# Altium project MagControl.PrjPCB (part 1 of 2)
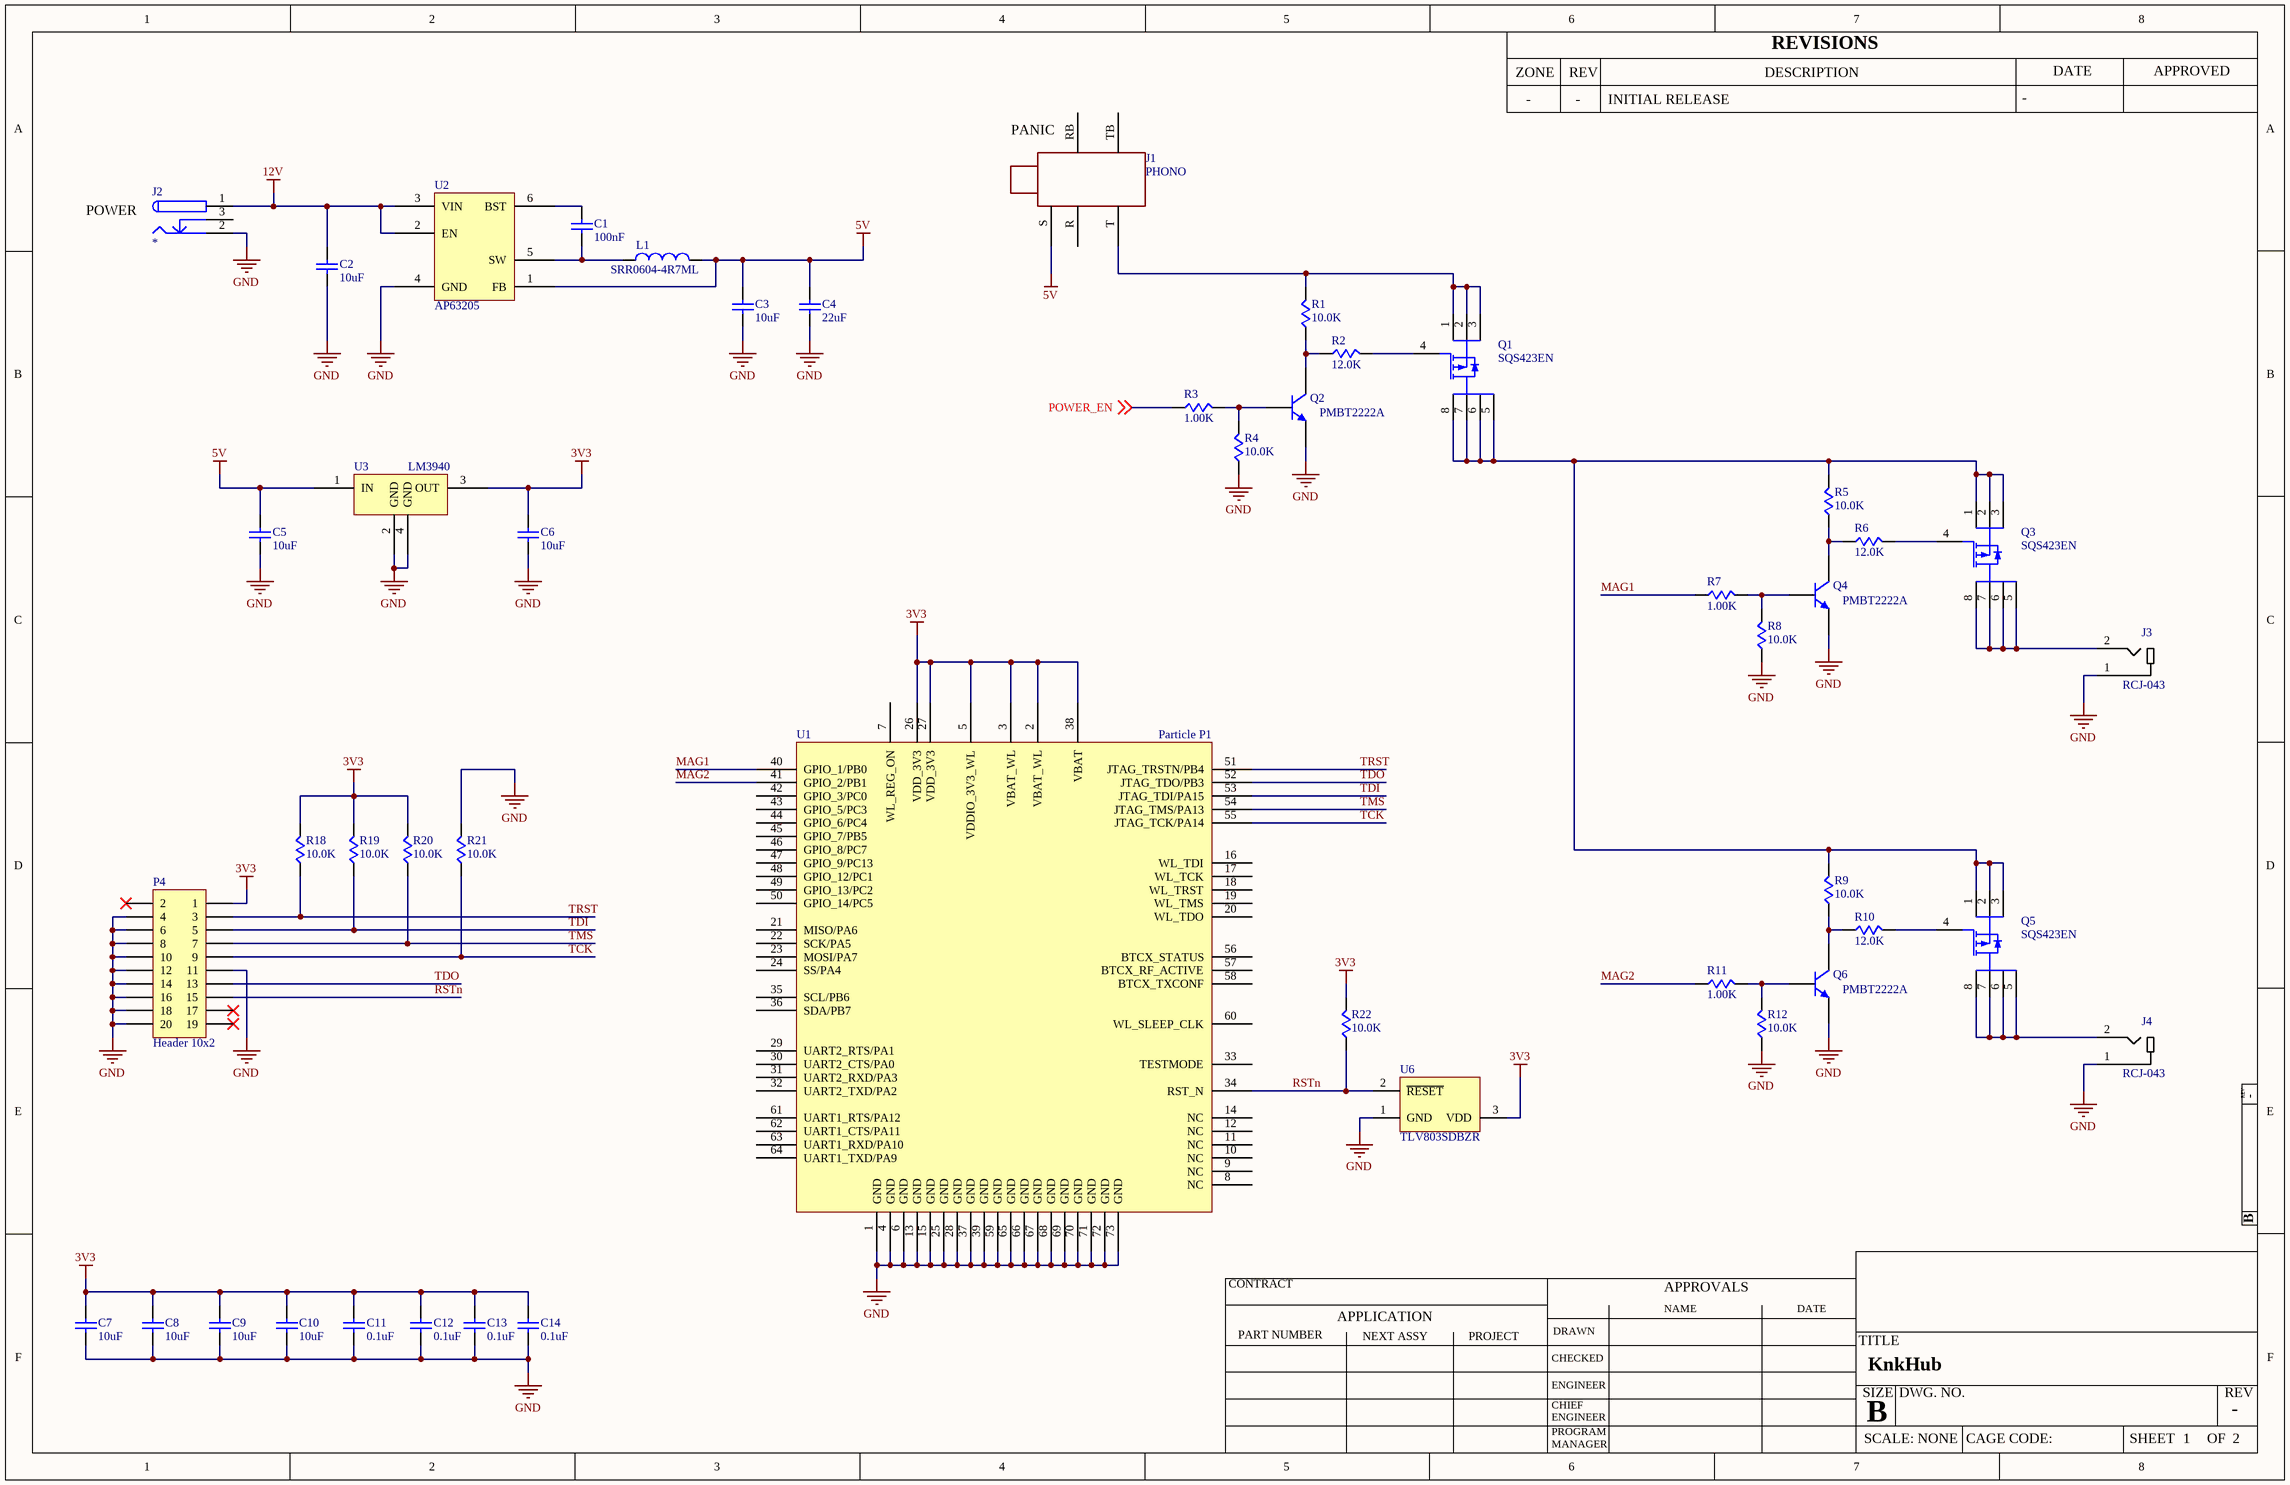
[diagram p0: SCH_MagControl_Sheet1.SchDoc]
2 sheets, 68 parts. Net scope: global (net labels, ports and power ports of the same name join across sheets).
Board file: MagControl.PcbDoc
Sheets:
  SCH_MagControl_Sheet1.SchDoc
  SCH_MagControl_Sheet2.SchDoc

## Sheet SCH_MagControl_Sheet1.SchDoc: KnkHub
size 431 x 279 mm; Revision: -; SheetNumber: 1; SheetTotal: 2; PageSetup: Record=PageOptions|CenterHorizontal=True|CenterVertical=True|PrintScale=0.98|XCorrection=1.00|YCorrection=1.00|PrintKind=1|BorderSize=5000000|LeftOffset=0|BottomOffset=0|Orientation=2|PaperLength=1000|PaperWidth=1000|Scale=100|PaperSource=15|PrintQuality=600|MediaType=1|DitherType=10|PaperKind=11 x 17|PrintScaleMode=1

### Parts
C1  value 100nF  [CAPC1608L]
C2  value 10uF  [CAPC2012L]
C3  value 10uF  [CAPC2012L]
C4  value 22uF  [CAPC2012L]
C5  value 10uF  [CAPC1608L]
C6  value 10uF  [CAPC1608L]
C7  value 10uF  [CAPC1608L]
C8  value 10uF  [CAPC1608L]
C9  value 10uF  [CAPC1608L]
C10  value 10uF  [CAPC1608L]
C11  value 0.1uF  [CAPC2012L]
C12  value 0.1uF  [CAPC2012L]
C13  value 0.1uF  [CAPC2012L]
C14  value 0.1uF  [CAPC2012L]
J1  value PHONO  [SN37A12]
J2  (no value)  [PJ-002B-SMT]
J3  value RCJ-043  [CUI_RCJ-043]
J4  value RCJ-043  [CUI_RCJ-043]
L1  value SRR0604-4R7ML  [IND_BOURNS_SRR06]
P4  value Header 10x2  [C-5103308-5]
Q1  value SQS423EN  [POWER-PAK 1212-8]
Q2  value PMBT2222A  [SOT23_N]
Q3  value SQS423EN  [POWER-PAK 1212-8]
Q4  value PMBT2222A  [SOT23_N]
Q5  value SQS423EN  [POWER-PAK 1212-8]
Q6  value PMBT2222A  [SOT23_N]
R1  value 10.0K  [RESC1005N]
R2  value 12.0K  [RESC1005N]
R3  value 1.00K  [RESC1005N]
R4  value 10.0K  [RESC1005N]
R5  value 10.0K  [RESC1005N]
R6  value 12.0K  [RESC1005N]
R7  value 1.00K  [RESC1005N]
R8  value 10.0K  [RESC1005N]
R9  value 10.0K  [RESC1005N]
R10  value 12.0K  [RESC1005N]
R11  value 1.00K  [RESC1005N]
R12  value 10.0K  [RESC1005N]
R18  value 10.0K  [RESC1005N]
R19  value 10.0K  [RESC1005N]
R20  value 10.0K  [RESC1005N]
R21  value 10.0K  [RESC1005N]
R22  value 10.0K  [RESC1005N]
U1  value Particle P1  [PARTICLE_P1]
U2  value AP63205  [TSOT26-6N]
U3  value LM3940  [SOT223-4N]
U6  value TLV803SDBZR  [DBZ0003A_L]

### Nets
3V3: C6.2 C7.2 C8.2 C9.2 C10.2 C11.2 C12.2 C13.2 C14.2 P4.1 R18.2 R19.2 R20.2 R22.2 U1.2(VBAT_WL) U1.3(VBAT_WL) U1.5(VDDIO_3V3_WL) U1.26(VDD_3V3) U1.27(VDD_3V3) U1.38(VBAT) U3.3(OUT) U6.3(VDD)
5V: C3.2 C4.2 C5.2 J1.S L1.2 U2.1(FB) U3.1(IN)
12V: C2.2 J2.1 U2.2(EN) U2.3(VIN)
GND: C2.1 C3.1 C4.1 C5.1 C6.1 C7.1 C8.1 C9.1 C10.1 C11.1 C12.1 C13.1 C14.1 J2.2 J3.1 J4.1 P4.4 P4.6 P4.8 P4.10 P4.11 P4.12 P4.14 P4.16 P4.18 P4.20 Q2.2(E) Q4.2(E) Q6.2(E) R4.1 R8.1 R12.1 R21.2 U1.1(GND) U1.4(GND) U1.6(GND) U1.13(GND) U1.15(GND) U1.25(GND) U1.28(GND) U1.37(GND) U1.39(GND) U1.59(GND) U1.65(GND) U1.66(GND) U1.67(GND) U1.68(GND) U1.69(GND) U1.70(GND) U1.71(GND) U1.72(GND) U1.73(GND) U2.4(GND) U3.2(GND) U3.4(GND) U6.1(GND)
MAG1: R7.1 U1.40(GPIO_1/PB0)
MAG2: R11.1 U1.41(GPIO_2/PB1)
POWER_EN: R3.1 ; off-sheet POWER_EN
RSTn: P4.15 R22.1 U1.34(RST_N) U6.2(~{RESET})
TCK: P4.9 R21.1 U1.55(JTAG_TCK/PA14)
TDI: P4.5 R19.1 U1.53(JTAG_TDI/PA15)
TDO: P4.13 U1.52(JTAG_TDO/PB3)
TMS: P4.7 R20.1 U1.54(JTAG_TMS/PA13)
TRST: P4.3 R18.1 U1.51(JTAG_TRSTN/PB4)
NetC1_1: C1.1 L1.1 U2.5(SW)
NetC1_2: C1.2 U2.6(BST)
NetJ1_T: J1.T Q1.1(S) Q1.2(S) Q1.3(S) R1.2
NetJ3_2: J3.2 Q3.5(D) Q3.6(D) Q3.7(D) Q3.8(D)
NetJ4_2: J4.2 Q5.5(D) Q5.6(D) Q5.7(D) Q5.8(D)
NetQ1_4: Q1.4(G) R2.2
NetQ1_5: Q1.5(D) Q1.6(D) Q1.7(D) Q1.8(D) Q3.1(S) Q3.2(S) Q3.3(S) Q5.1(S) Q5.2(S) Q5.3(S) R5.2 R9.2
NetQ2_1: Q2.1(B) R3.2 R4.2
NetQ2_3: Q2.3(C) R1.1 R2.1
NetQ3_4: Q3.4(G) R6.2
NetQ4_1: Q4.1(B) R7.2 R8.2
NetQ4_3: Q4.3(C) R5.1 R6.1
NetQ5_4: Q5.4(G) R10.2
NetQ6_1: Q6.1(B) R11.2 R12.2
NetQ6_3: Q6.3(C) R9.1 R10.1

Not connected (* = marked no-connect by the designer): J1 R RB TB; J2 3; P4 2* 17* 19*; U1 7(WL_REG_ON) 8(NC) 9(NC) 10(NC) 11(NC) 12(NC) 14(NC) 16(WL_TDI) 17(WL_TCK) 18(WL_TRST) 19(WL_TMS) 20(WL_TDO) 21(MISO/PA6) 22(SCK/PA5) 23(MOSI/PA7) 24(SS/PA4) 29(UART2_RTS/PA1) 30(UART2_CTS/PA0) 31(UART2_RXD/PA3) 32(UART2_TXD/PA2) 33(TESTMODE) 35(SCL/PB6) 36(SDA/PB7) 42(GPIO_3/PC0) 43(GPIO_5/PC3) 44(GPIO_6/PC4) 45(GPIO_7/PB5) 46(GPIO_8/PC7) 47(GPIO_9/PC13) 48(GPIO_12/PC1) 49(GPIO_13/PC2) 50(GPIO_14/PC5) 56(BTCX_STATUS) 57(BTCX_RF_ACTIVE) 58(BTCX_TXCONF) 60(WL_SLEEP_CLK) 61(UART1_RTS/PA12) 62(UART1_CTS/PA11) 63(UART1_RXD/PA10) 64(UART1_TXD/PA9)

### Notes on the sheet
- (near J1) PANIC
- POWER
- ZONE
- REV
- DESCRIPTION
- REVISIONS
- DATE
- APPROVED
- -
- INITIAL RELEASE
- B
- CONTRACT
- APPROVALS
- PART NUMBER
- APPLICATION
- NEXT ASSY
- PROJECT
- CHECKED
- DRAWN
- NAME
- TITLE
- ENGINEER
- CHIEF
- PROGRAM
- SIZE
- DWG. NO.
- MANAGER
- SCALE: NONE
- CAGE CODE:
- SHEET
- OF

### Library data of the parts
C1 = Cap Semi: Capacitor (SMD); Manufacturer 1: Samsung; Manufacturer Part Number 1: CL10B104KO8NNNC; Material: Ceramic; Dielectric: X7R; Tolerance: 10%; Voltage Rating (DC): 16V; ComponentLink1URL: https://datasheet.ciiva.com/26838/getdatasheetpartid-357417-26838418.pdf?src-supplier=Verical; ComponentLink1Description: https://datasheet.ciiva.com/26838/getdatasheetpartid-357417-26838418.pdf?src-supplier=Verical; ComponentLink2URL: https://datasheet.ciiva.com/25805/cl10b104ko8nnnc-25805483.pdf?src-supplier=Digi-Key; ComponentLink2Description: https://datasheet.ciiva.com/25805/cl10b104ko8nnnc-25805483.pdf?src-supplier=Digi-Key; ComponentLink3URL: https://datasheet.ciiva.com/29198/456679-da-01-en-vs-kondensator-0603-29198846.pdf?src-supplier=Conrad; ComponentLink3Description: https://datasheet.ciiva.com/29198/456679-da-01-en-vs-kondensator-0603-29198846.pdf?src-supplier=Conrad; Supplier 1: Digi-Key; Supplier Part Number 1: 1276-1005-1-ND; Mount: Surface Mount; Case/Package: 0603; Case Code (Metric): 1608; Case Code (Imperial): 0603; Contact Plating: Tin; Min Operating Temperature: -55°C; Max Operating Temperature: 125°C; Capacitance: 100nF; Packaging: Tape and Reel; Package Quantity: 1; Voltage Rating: 16V; Voltage: 16V; Length: 1.6mm; Height: 0.8mm; Depth: 0.8mm; Width: 0.031inch; Thickness: 0.035inch; Radiation Hardening: No; Lead Free: Lead Free
C2 C3 = Cap Semi: Capacitor (SMD); Manufacturer 1: Samsung; Manufacturer Part Number 1: CL21A106KOQNNNG; Material: Ceramic; Tolerance: 10%; Dielectric: X5R; Voltage: 16V; ComponentLink1URL: https://datasheet.ciiva.com/16428/cl21a106kpfnnng-16428896.pdf?src-supplier=Future+Electronics; ComponentLink1Description: https://datasheet.ciiva.com/16428/cl21a106kpfnnng-16428896.pdf?src-supplier=Future+Electronics; ComponentLink2URL: https://datasheet.ciiva.com/26936/getdatasheetpartid-640497-26936900.pdf?src-supplier=Verical; ComponentLink2Description: https://datasheet.ciiva.com/26936/getdatasheetpartid-640497-26936900.pdf?src-supplier=Verical; ComponentLink3URL: https://datasheet.ciiva.com/25730/cl21a106koqnnng-25730226.pdf?src-supplier=Digi-Key; ComponentLink3Description: https://datasheet.ciiva.com/25730/cl21a106koqnnng-25730226.pdf?src-supplier=Digi-Key; ComponentLink4URL: https://datasheet.ciiva.com/29199/454932-da-01-en-vs-kondensator-0805-29199423.pdf?src-supplier=Conrad; ComponentLink4Description: https://datasheet.ciiva.com/29199/454932-da-01-en-vs-kondensator-0805-29199423.pdf?src-supplier=Conrad; Supplier 1: Digi-Key; Supplier Part Number 1: 1276-6455-6-ND; Mount: Surface Mount; Case/Package: 0805; Case Code (Metric): 2012; Case Code (Imperial): 0805; Min Operating Temperature: -55°C; Max Operating Temperature: 85°C; Capacitance: 10uF; Packaging: Tape and Reel; Package Quantity: 3000; Voltage Rating: 16V; Length: 2mm; Height: 1.25mm; Depth: 1.25mm; Width: 0.049inch; Thickness: 0.053inch
C4 = Cap Semi: Capacitor (SMD); Manufacturer 1: Samsung; Manufacturer Part Number 1: CL21A226KQCLRNC; Voltage Rating: 6.3V; Tolerance: 10%; Supplier 1: Digi-Key; Supplier Part Number 1: 1276-6687-1-ND; Mount: Surface Mount; Case/Package: 0805; Case Code (Metric): 2012; Case Code (Imperial): 0805; Min Operating Temperature: -55°C; Max Operating Temperature: 85°C; Packaging: Tape and Reel; Capacitance: 22uF; Length: 0.079inch; Width: 0.049inch; Thickness: 0.037inch; ComponentLink1URL: http://www.samsungsem.com/kr/support/product-search/mlcc/CL21A226KQCLRNC.jsp?src-supplier=Digi-Key; ComponentLink1Description: http://www.samsungsem.com/kr/support/product-search/mlcc/CL21A226KQCLRNC.jsp?src-supplier=Digi-Key
C5-C10 = Cap Semi: Capacitor (SMD); Manufacturer 1: Samsung; Manufacturer Part Number 1: CL10A106MQ8NNNC; Tolerance: 20%; Voltage Rating: 6.3V; Dielectric: X5R; Supplier 1: Digi-Key; Supplier Part Number 1: 1276-1119-1-ND; Mount: Surface Mount; Case/Package: 0603; Case Code (Metric): 1608; Case Code (Imperial): 0603; Contact Plating: Tin; Min Operating Temperature: -55°C; Max Operating Temperature: 85°C; Capacitance: 10uF; Package Quantity: 1; Packaging: Tape and Reel; Voltage: 6.3V; Length: 1.6mm; Height: 0.8mm; Width: 0.031inch; Thickness: 0.035inch; Depth: 0.8mm; Radiation Hardening: No; ComponentLink1URL: https://datasheet.ciiva.com/25798/cl10a106mq8nnnc-25798320.pdf?src-supplier=Digi-Key; ComponentLink1Description: https://datasheet.ciiva.com/25798/cl10a106mq8nnnc-25798320.pdf?src-supplier=Digi-Key; ComponentLink2URL: https://datasheet.ciiva.com/26838/getdatasheetpartid-357557-26838347.pdf?src-supplier=Verical; ComponentLink2Description: https://datasheet.ciiva.com/26838/getdatasheetpartid-357557-26838347.pdf?src-supplier=Verical; ComponentLink3URL: https://datasheet.ciiva.com/16437/cl05b104kq5nnnc-16437327.pdf?src-supplier=Future+Electronics; ComponentLink3Description: https://datasheet.ciiva.com/16437/cl05b104kq5nnnc-16437327.pdf?src-supplier=Future+Electronics; ComponentLink4URL: http://www.samsungsem.com/kr/support/product-search/mlcc/CL10X106MO8NRNC.jsp?src-supplier=Digi-Key; ComponentLink4Description: http://www.samsungsem.com/kr/support/product-search/mlcc/CL10X106MO8NRNC.jsp?src-supplier=Digi-Key
C11-C14 = Cap Semi: Capacitor (SMD); Manufacturer 1: Samsung; Manufacturer Part Number 1: CL05A104MP5NNNC; Capacitance: 100nF; Tolerance: 20%; Voltage Rating: 10V; Dielectric: X5R; Supplier 1: Digi-Key; Supplier Part Number 1: 1276-1443-1-ND; Mount: Surface Mount; Case/Package: 0402; Case Code (Metric): 1005; Case Code (Imperial): 0402; Min Operating Temperature: -55°C; Max Operating Temperature: 85°C; Packaging: Tape and Reel; Voltage Rating (DC): 10V; Length: 1mm; Height: 0.5mm; Width: 0.02inch; Thickness: 0.022inch; Depth: 0.5mm; Radiation Hardening: No; Lead Free: Lead Free; ComponentLink1URL: https://datasheet.ciiva.com/25709/cl05a104mp5nnnc-25709105.pdf?src-supplier=Digi-Key; ComponentLink1Description: https://datasheet.ciiva.com/25709/cl05a104mp5nnnc-25709105.pdf?src-supplier=Digi-Key
J1 = PHONO_250: Manufacturer 1: Switchcraft; Manufacturer Part Number 1: SN37A12A; Gender: Female; Shielding: Unshielded; Voltage Rating: 500V; Number of Ports: 1; Number of Contacts: 2; Pitch: 7.62mm; Supplier 1: Digi-Key; Supplier Part Number 1: SC2014-ND; Mount: Through Hole; Contact Material: Brass; Color: Black; Contact Plating: Nickel; Number of Terminals: 4; Housing Color: Black; Housing Material: Thermoplastic; Package Quantity: 1; Termination: Solder; Orientation: Right Angle; Number of Positions: 2; Length: 15.87mm; Lead Free: Lead Free; ComponentLink1URL: https://datasheet.ciiva.com/390/sn37a1-cd-390736.pdf?src-supplier=Digi-Key; ComponentLink1Description: https://datasheet.ciiva.com/390/sn37a1-cd-390736.pdf?src-supplier=Digi-Key; ComponentLink2URL: https://datasheet.ciiva.com/16148/jack-95-16148456.pdf?src-supplier=Onlinecomponents.com; ComponentLink2Description: https://datasheet.ciiva.com/16148/jack-95-16148456.pdf?src-supplier=Onlinecomponents.com
J2 = PWR2.5: Low Voltage Power Supply Connector; Manufacturer 1: CUI; Manufacturer Part Number 1: PJ-002BH; Gender: Male; Shielding: Unshielded; Current Rating: 5A; Connector Type: Jack; Voltage Rating: 24V; Insulation Resistance: 100MR; Number of Conductors: 2; Value: *; Supplier 1: Digi-Key; Supplier Part Number 1: CP-002BH-ND; Mount: Through Hole; Color: Black; Contact Material: Copper; Contact Plating: Nickel; Housing Color: Black; Housing Material: Thermoplastic; Min Operating Temperature: -25°C; Max Operating Temperature: 85°C; Termination: Through Hole; Package Quantity: 500; Packaging: Bulk; Contact Gender: Male; Orientation: Horizontal; Diameter: 2.5mm; Lead Free: Lead Free; Flammability Rating: UL94 V-0; ComponentLink1URL: http://www.mouser.com/ds/2/670/pj-002bh-528069.pdf?src-supplier=Mouser; ComponentLink1Description: http://www.mouser.com/ds/2/670/pj-002bh-528069.pdf?src-supplier=Mouser; ComponentLink2URL: http://www.cui.com/Product/Resource/FuturePDF/PJ-002BH.pdf?src-supplier=Future+Electronics; ComponentLink2Description: http://www.cui.com/Product/Resource/FuturePDF/PJ-002BH.pdf?src-supplier=Future+Electronics; ComponentLink3URL: https://www.cui.com/product/resource/digikeypdf/pj-002bh.pdf?src-supplier=Digi-Key; ComponentLink3Description: https://www.cui.com/product/resource/digikeypdf/pj-002bh.pdf?src-supplier=Digi-Key
J3 J4 = RCJ-043: CONN RCA JACK MONO 3.2MM R/A; Manufacturer 1: CUI; Body Material: Brass; Gender: Female; Shielding: Unshielded; Number of Ports: 1; Supplier 1: Digi-Key; Supplier Part Number 1: CP-1420-ND; Manufacturer Part Number 1: RCJ-043; Mount: Through Hole; Contact Plating: Nickel; Color: White; Insulation Color: White; Packaging: Bulk; Termination: Solder; Orientation: Horizontal; Connector Type: Jack; Lead Free: Lead Free; ComponentLink1URL: https://www.cui.com/product/resource/digikeypdf/rcj-04x.pdf?src-supplier=Digi-Key; ComponentLink1Description: https://www.cui.com/product/resource/digikeypdf/rcj-04x.pdf?src-supplier=Digi-Key
L1 = Inductor: Manufacturer 1: Bourns; Core Material: Ferrite; Material: Steel; Tolerance: 20%; Inductance: 4.7uH; DC Resistance (DCR): 60mR; Max DC Current: 2A; Saturation Current: 2.55A; Shielding: Shielded; Self Resonant Frequency: 50MHz; Q Factor: 10; Test Frequency: 1kHz; Manufacturer Part Number 1: SRR0604-4R7ML; Supplier 1: Digi-Key; Supplier Part Number 1: SRR0604-4R7MLCT-ND; Mount: Surface Mount; Case/Package: Nonstandard; Number of Pins: 2; Min Operating Temperature: -40°C; Max Operating Temperature: 125°C; Package Quantity: 1; Current Rating: 2A; Packaging: Tape and Reel; Inductance Tolerance: 20%; Frequency: 50MHz; Resistance: 60MR; Composition: Wirewound; Termination: SMD/SMT; DC Current: 2A; Military Standard: Not; RMS Current (Irms): 2A; Length: 6.5mm; Height: 4.8mm; Width: 6.5mm; Height - Seated (Max): 0.189inch; Depth: 6.7mm; REACH SVHC: No SVHC; ComponentLink1URL: https://datasheet.ciiva.com/7849/1723201-7849753.pdf?src-supplier=Element14; ComponentLink1Description: https://datasheet.ciiva.com/7849/1723201-7849753.pdf?src-supplier=Element14; ComponentLink2URL: https://datasheet.ciiva.com/30139/srr0604-30139818.pdf?src-supplier=Onlinecomponents.com; ComponentLink2Description: https://datasheet.ciiva.com/30139/srr0604-30139818.pdf?src-supplier=Onlinecomponents.com; ComponentLink3URL: https://datasheet.ciiva.com/1062/srr0604-1062306.pdf?src-supplier=Digi-Key; ComponentLink3Description: https://datasheet.ciiva.com/1062/srr0604-1062306.pdf?src-supplier=Digi-Key; ComponentLink4URL: https://datasheet.ciiva.com/8517/srr0604-8517206.pdf?src-supplier=Avnet; ComponentLink4Description: https://datasheet.ciiva.com/8517/srr0604-8517206.pdf?src-supplier=Avnet; ComponentLink5URL: https://datasheet.ciiva.com/7849/1483755-7849754.pdf?src-supplier=Element14; ComponentLink5Description: https://datasheet.ciiva.com/7849/1483755-7849754.pdf?src-supplier=Element14; ComponentLink6URL: https://datasheet.ciiva.com/17247/srr0604-17247630.pdf?src-supplier=Avnet+Europe; ComponentLink6Description: https://datasheet.ciiva.com/17247/srr0604-17247630.pdf?src-supplier=Avnet+Europe
P4 = HEADER10X2: Manufacturer Part Number 1: 51033085; Manufacturer 1: TE Connectivity; Number of Contacts: 20; Connector Type: Plug; Mating Alignment: Yes (With); PCB Mount Retention: Without; PCB Mounting Orientation: Vertical; Current Rating: 1A; Insulation Resistance: 5GR; Max Voltage Rating (AC): 250V; Board Standoff: No (Without); Connector System: Wire-to-Board; Pitch: 2.54mm; Contact Post Length: 0.12inch; Supplier 1: Digi-Key; Supplier Part Number 1: A33165-ND; Mount: Through Hole; Contact Plating: Gold; Contact Material: Copper Alloy; Color: Black; Housing Color: Black; Housing Material: PBT; Contact Shape: Square; Min Operating Temperature: -65°C; Max Operating Temperature: 105°C; Number of Rows: 2; Termination: Through Hole; Packaging: Rail/Tube; Package Quantity: 35; Number of Positions: 20; Orientation: Straight; Contact Current Rating: 1A; Contact Gender: Male; PCB Mount Alignment: No (Without); Shrouded: Yes (With); Mating Connector Lock: No (Without); Mating Retention: No (Without); Voltage Rating: 250V; Length: 33.02mm; Height: 8.813mm; Row Spacing: 2.54mm; Depth: 9.14mm; Contact Mating Length: 0.24inch; Shrouded End Dimension: 3.81mm; Flammability Rating: UL94 V-0; REACH SVHC: No SVHC; ComponentLink1URL: https://datasheet.ciiva.com/11750/0900766b804f3401-11750371.pdf?src-supplier=RSComponents; ComponentLink1Description: https://datasheet.ciiva.com/11750/0900766b804f3401-11750371.pdf?src-supplier=RSComponents; ComponentLink2URL: https://datasheet.ciiva.com/19463/753539-19463412.pdf?src-supplier=Jameco; ComponentLink2Description: https://datasheet.ciiva.com/19463/753539-19463412.pdf?src-supplier=Jameco; ComponentLink3URL: https://datasheet.ciiva.com/30233/eng-ds-1307819-ampmodu-0811-30233221.pdf?src-supplier=Onlinecomponents.com; ComponentLink3Description: https://datasheet.ciiva.com/30233/eng-ds-1307819-ampmodu-0811-30233221.pdf?src-supplier=Onlinecomponents.com; ComponentLink4URL: https://datasheet.ciiva.com/14638/70042631-14638263.pdf?src-supplier=Allied+Electronics; ComponentLink4Description: https://datasheet.ciiva.com/14638/70042631-14638263.pdf?src-supplier=Allied+Electronics; ComponentLink5URL: https://datasheet.ciiva.com/710/eng-cd-5103308-e-710220.pdf?src-supplier=Digi-Key; ComponentLink5Description: https://datasheet.ciiva.com/710/eng-cd-5103308-e-710220.pdf?src-supplier=Digi-Key
Q1 Q3 Q5 = MOSFET-P_PPAK: MOSFET P-CH PPAK-8; Manufacturer 1: Vishay Semiconductors; Manufacturer Part Number 1: SQS423EN-T1_GE3; Rise Time: 43ns; Continuous Drain Current (ID): 16A; Turn-On Delay Time: 65ns; Turn-Off Delay Time: 23ns; Fall Time: 15ns; Gate to Source Voltage (Vgs): 20V; Number of Elements: 1; Power Dissipation: 62.5W; Supplier 1: Digi-Key; Supplier Part Number 1: SQS423EN-T1_GE3CT-ND; Mount: Surface Mount; Number of Pins: 8; Min Operating Temperature: -55°C; Max Operating Temperature: 175°C; Packaging: Tape and Reel; Radiation Hardening: No; ComponentLink1URL: https://datasheet.ciiva.com/26133/sqs423en-26133606.pdf?src-supplier=Avnet+Europe; ComponentLink1Description: https://datasheet.ciiva.com/26133/sqs423en-26133606.pdf?src-supplier=Avnet+Europe; ComponentLink2URL: https://datasheet.ciiva.com/11160/sqs423en-11160394.pdf?src-supplier=Avnet; ComponentLink2Description: https://datasheet.ciiva.com/11160/sqs423en-11160394.pdf?src-supplier=Avnet
Q2 Q4 Q6 = PMBT2222: TRANS NPN SW 600MA 40V SOT23; Manufacturer Part Number 1: PMBT2222A,215; Manufacturer 1: Nexperia; Supplier 1: Digi-Key; Supplier Part Number 1: 1727-2956-1-ND; ComponentLink1URL: http://www.farnell.com/datasheets/1274664.pdf?src-supplier=Farnell; ComponentLink1Description: http://www.farnell.com/datasheets/1274664.pdf?src-supplier=Farnell
R1 R4 R5 R8 R9 R12 = R: RES 10.0K OHM 1/10W 1% 0402 SMD; Manufacturer 1: Panasonic; Manufacturer Part Number 1: ERJ-2RKF1002X; Resistance: 10kR; Temperature Coefficient: 100ppm/°C; Power Rating: 100mW; Voltage Rating: 50V; Supplier 1: Digi-Key; Supplier Part Number 1: P10.0KLCT-ND; Mount: Surface Mount; Case/Package: 0402; Number of Pins: 2; Contact Plating: Tin; Case Code (Metric): 1005; Case Code (Imperial): 0402; Min Operating Temperature: -55°C; Max Operating Temperature: 155°C; Tolerance: 1%; Composition: Thick Film; Packaging: Tape and Reel; Package Quantity: 1; Number of Terminations: 2; Termination: SMD/SMT; Military Standard: Not; Max Power Dissipation: 100mW; Voltage Rating (DC): 50V; Features: Automotive AEC-Q200; Length: 1mm; Height: 0.35mm; Width: 0.02inch; Depth: 0.5mm; Radiation Hardening: No; REACH SVHC: No SVHC; Lead Free: Lead Free; ComponentLink1URL: https://datasheet.ciiva.com/11821/0900766b80f80784-11821171.pdf?src-supplier=RSComponents; ComponentLink1Description: https://datasheet.ciiva.com/11821/0900766b80f80784-11821171.pdf?src-supplier=RSComponents; ComponentLink2URL: https://datasheet.ciiva.com/17212/aoa0000ce2-17212102.pdf?src-supplier=Avnet+Europe; ComponentLink2Description: https://datasheet.ciiva.com/17212/aoa0000ce2-17212102.pdf?src-supplier=Avnet+Europe; ComponentLink3URL: https://datasheet.ciiva.com/28514/1678782-28514185.pdf?src-supplier=Element14; ComponentLink3Description: https://datasheet.ciiva.com/28514/1678782-28514185.pdf?src-supplier=Element14; ComponentLink4URL: https://datasheet.ciiva.com/43467/1678782-43467402.pdf?src-supplier=Farnell; ComponentLink4Description: https://datasheet.ciiva.com/43467/1678782-43467402.pdf?src-supplier=Farnell; ComponentLink5URL: https://datasheet.ciiva.com/27055/1987020-27055643.pdf?src-supplier=Jameco; ComponentLink5Description: https://datasheet.ciiva.com/27055/1987020-27055643.pdf?src-supplier=Jameco; ComponentLink6URL: https://datasheet.ciiva.com/48531/aoa0000ce2-48531069.pdf?src-supplier=Avnet; ComponentLink6Description: https://datasheet.ciiva.com/48531/aoa0000ce2-48531069.pdf?src-supplier=Avnet; ComponentLink7URL: https://datasheet.ciiva.com/30201/aoa0000ce2-30201022.pdf?src-supplier=Onlinecomponents.com; ComponentLink7Description: https://datasheet.ciiva.com/30201/aoa0000ce2-30201022.pdf?src-supplier=Onlinecomponents.com; ComponentLink8URL: https://datasheet.ciiva.com/16199/aoa0000ce2-16199478.pdf?src-supplier=Future+Electronics; ComponentLink8Description: https://datasheet.ciiva.com/16199/aoa0000ce2-16199478.pdf?src-supplier=Future+Electronics; ComponentLink9URL: https://datasheet.ciiva.com/24023/aoa0000ce2-24023017.pdf?src-supplier=Mouser; ComponentLink9Description: https://datasheet.ciiva.com/24023/aoa0000ce2-24023017.pdf?src-supplier=Mouser; ComponentLink10URL: https://datasheet.ciiva.com/9194/aoa0000ce2-9194142.pdf?src-supplier=Avnet; ComponentLink10Description: https://datasheet.ciiva.com/9194/aoa0000ce2-9194142.pdf?src-supplier=Avnet; ComponentLink11URL: https://datasheet.ciiva.com/16782/70260748-16782590.pdf?src-supplier=Allied+Electronics; ComponentLink11Description: https://datasheet.ciiva.com/16782/70260748-16782590.pdf?src-supplier=Allied+Electronics; ComponentLink12URL: https://datasheet.ciiva.com/16786/70260748-16786734.pdf?src-supplier=Allied+Electronics; ComponentLink12Description: https://datasheet.ciiva.com/16786/70260748-16786734.pdf?src-supplier=Allied+Electronics
R2 R6 R10 = R: RES 12.0K OHM 1/10W 1% 0402 SMD; Manufacturer 1: Panasonic; Manufacturer Part Number 1: ERJ-2RKF1202X; Resistance: 12kR; Power Rating: 100mW; Voltage Rating: 50V; Temperature Coefficient: 100ppm/°C; Supplier 1: Digi-Key; Supplier Part Number 1: P12.0KLCT-ND; Mount: Surface Mount; Case/Package: 0402; Number of Pins: 2; Case Code (Metric): 1005; Case Code (Imperial): 0402; Contact Plating: Tin; Min Operating Temperature: -55°C; Max Operating Temperature: 155°C; Tolerance: 1%; Packaging: Tape and Reel; Package Quantity: 1; Composition: Thick Film; Number of Terminations: 2; Termination: SMD/SMT; Military Standard: Not; Max Power Dissipation: 100mW; Voltage Rating (DC): 50V; Features: Automotive AEC-Q200; Length: 1mm; Height: 0.35mm; Width: 0.02inch; Depth: 0.5mm; REACH SVHC: No SVHC; Lead Free: Lead Free; ComponentLink1URL: https://datasheet.ciiva.com/7944/426256-7944939.pdf?src-supplier=Element14; ComponentLink1Description: https://datasheet.ciiva.com/7944/426256-7944939.pdf?src-supplier=Element14; ComponentLink2URL: https://datasheet.ciiva.com/7944/aoa0000ce2-7944604.pdf?src-supplier=Element14; ComponentLink2Description: https://datasheet.ciiva.com/7944/aoa0000ce2-7944604.pdf?src-supplier=Element14; ComponentLink3URL: https://datasheet.ciiva.com/22673/1678782-22673676.pdf?src-supplier=Element14; ComponentLink3Description: https://datasheet.ciiva.com/22673/1678782-22673676.pdf?src-supplier=Element14; ComponentLink4URL: https://datasheet.ciiva.com/46373/1678782-46373164.pdf?src-supplier=Element14; ComponentLink4Description: https://datasheet.ciiva.com/46373/1678782-46373164.pdf?src-supplier=Element14; ComponentLink5URL: https://datasheet.ciiva.com/22687/1678782-22687405.pdf?src-supplier=Element14; ComponentLink5Description: https://datasheet.ciiva.com/22687/1678782-22687405.pdf?src-supplier=Element14; ComponentLink6URL: https://datasheet.ciiva.com/46373/1678782-46373165.pdf?src-supplier=Element14; ComponentLink6Description: https://datasheet.ciiva.com/46373/1678782-46373165.pdf?src-supplier=Element14
R3 = R: RES 1.00K OHM 1/10W 1% 0402 SMD; Manufacturer 1: Panasonic; Manufacturer Part Number 1: ERJ-2RKF1001X; Resistance: 10kR; Temperature Coefficient: 100ppm/°C; Power Rating: 100mW; Voltage Rating: 50V; Supplier 1: Digi-Key; Supplier Part Number 1: P1.00KLCT-ND; Mount: Surface Mount; Case/Package: 0402; Number of Pins: 2; Contact Plating: Tin; Case Code (Metric): 1005; Case Code (Imperial): 0402; Min Operating Temperature: -55°C; Max Operating Temperature: 155°C; Tolerance: 1%; Composition: Thick Film; Packaging: Tape and Reel; Package Quantity: 1; Number of Terminations: 2; Termination: SMD/SMT; Military Standard: Not; Max Power Dissipation: 100mW; Voltage Rating (DC): 50V; Features: Automotive AEC-Q200; Length: 1mm; Height: 0.35mm; Width: 0.02inch; Depth: 0.5mm; Radiation Hardening: No; REACH SVHC: No SVHC; Lead Free: Lead Free; ComponentLink1URL: https://datasheet.ciiva.com/11821/0900766b80f80784-11821171.pdf?src-supplier=RSComponents; ComponentLink1Description: https://datasheet.ciiva.com/11821/0900766b80f80784-11821171.pdf?src-supplier=RSComponents; ComponentLink2URL: https://datasheet.ciiva.com/17212/aoa0000ce2-17212102.pdf?src-supplier=Avnet+Europe; ComponentLink2Description: https://datasheet.ciiva.com/17212/aoa0000ce2-17212102.pdf?src-supplier=Avnet+Europe; ComponentLink3URL: https://datasheet.ciiva.com/28514/1678782-28514185.pdf?src-supplier=Element14; ComponentLink3Description: https://datasheet.ciiva.com/28514/1678782-28514185.pdf?src-supplier=Element14; ComponentLink4URL: https://datasheet.ciiva.com/43467/1678782-43467402.pdf?src-supplier=Farnell; ComponentLink4Description: https://datasheet.ciiva.com/43467/1678782-43467402.pdf?src-supplier=Farnell; ComponentLink5URL: https://datasheet.ciiva.com/27055/1987020-27055643.pdf?src-supplier=Jameco; ComponentLink5Description: https://datasheet.ciiva.com/27055/1987020-27055643.pdf?src-supplier=Jameco; ComponentLink6URL: https://datasheet.ciiva.com/48531/aoa0000ce2-48531069.pdf?src-supplier=Avnet; ComponentLink6Description: https://datasheet.ciiva.com/48531/aoa0000ce2-48531069.pdf?src-supplier=Avnet; ComponentLink7URL: https://datasheet.ciiva.com/30201/aoa0000ce2-30201022.pdf?src-supplier=Onlinecomponents.com; ComponentLink7Description: https://datasheet.ciiva.com/30201/aoa0000ce2-30201022.pdf?src-supplier=Onlinecomponents.com; ComponentLink8URL: https://datasheet.ciiva.com/16199/aoa0000ce2-16199478.pdf?src-supplier=Future+Electronics; ComponentLink8Description: https://datasheet.ciiva.com/16199/aoa0000ce2-16199478.pdf?src-supplier=Future+Electronics; ComponentLink9URL: https://datasheet.ciiva.com/24023/aoa0000ce2-24023017.pdf?src-supplier=Mouser; ComponentLink9Description: https://datasheet.ciiva.com/24023/aoa0000ce2-24023017.pdf?src-supplier=Mouser; ComponentLink10URL: https://datasheet.ciiva.com/9194/aoa0000ce2-9194142.pdf?src-supplier=Avnet; ComponentLink10Description: https://datasheet.ciiva.com/9194/aoa0000ce2-9194142.pdf?src-supplier=Avnet; ComponentLink11URL: https://datasheet.ciiva.com/16782/70260748-16782590.pdf?src-supplier=Allied+Electronics; ComponentLink11Description: https://datasheet.ciiva.com/16782/70260748-16782590.pdf?src-supplier=Allied+Electronics; ComponentLink12URL: https://datasheet.ciiva.com/16786/70260748-16786734.pdf?src-supplier=Allied+Electronics; ComponentLink12Description: https://datasheet.ciiva.com/16786/70260748-16786734.pdf?src-supplier=Allied+Electronics; Working Voltage: 50V; ComponentLink13URL: https://datasheet.ciiva.com/11821/0900766b80f80784-11821203.pdf?src-supplier=RSComponents; ComponentLink13Description: https://datasheet.ciiva.com/11821/0900766b80f80784-11821203.pdf?src-supplier=RSComponents; ComponentLink14URL: https://datasheet.ciiva.com/16767/70260748-16767559.pdf?src-supplier=Allied+Electronics; ComponentLink14Description: https://datasheet.ciiva.com/16767/70260748-16767559.pdf?src-supplier=Allied+Electronics; ComponentLink15URL: https://datasheet.ciiva.com/9198/aoa0000ce2-9198920.pdf?src-supplier=Avnet; ComponentLink15Description: https://datasheet.ciiva.com/9198/aoa0000ce2-9198920.pdf?src-supplier=Avnet; ComponentLink16URL: https://datasheet.ciiva.com/7942/aoa0000ce2-7942426.pdf?src-supplier=Element14; ComponentLink16Description: https://datasheet.ciiva.com/7942/aoa0000ce2-7942426.pdf?src-supplier=Element14; ComponentLink17URL: https://datasheet.ciiva.com/16523/aoa0000ce2-16523834.pdf?src-supplier=Avnet+Asia; ComponentLink17Description: https://datasheet.ciiva.com/16523/aoa0000ce2-16523834.pdf?src-supplier=Avnet+Asia; ComponentLink18URL: https://datasheet.ciiva.com/16771/70260748-16771979.pdf?src-supplier=Allied+Electronics; ComponentLink18Description: https://datasheet.ciiva.com/16771/70260748-16771979.pdf?src-supplier=Allied+Electronics; ComponentLink19URL: https://datasheet.ciiva.com/17215/aoa0000ce2-17215308.pdf?src-supplier=Avnet+Europe; ComponentLink19Description: https://datasheet.ciiva.com/17215/aoa0000ce2-17215308.pdf?src-supplier=Avnet+Europe; ComponentLink20URL: https://datasheet.ciiva.com/22673/1678782-22673916.pdf?src-supplier=Element14; ComponentLink20Description: https://datasheet.ciiva.com/22673/1678782-22673916.pdf?src-supplier=Element14; ComponentLink21URL: https://datasheet.ciiva.com/28532/1678782-28532109.pdf?src-supplier=Element14; ComponentLink21Description: https://datasheet.ciiva.com/28532/1678782-28532109.pdf?src-supplier=Element14
R7 R11 = R: RES 1.00K OHM 1/10W 1% 0402 SMD; Manufacturer 1: Panasonic; Manufacturer Part Number 1: ERJ-2RKF1001X; Resistance: 1kR; Temperature Coefficient: 100ppm/°C; Voltage Rating: 50V; Power Rating: 100mW; Supplier 1: Digi-Key; Supplier Part Number 1: P1.00KLCT-ND; Mount: Surface Mount; Case/Package: 0402; Number of Pins: 2; Contact Plating: Tin; Case Code (Imperial): 0402; Case Code (Metric): 1005; Min Operating Temperature: -55°C; Max Operating Temperature: 155°C; Tolerance: 1%; Composition: Thick Film; Packaging: Tape and Reel; Package Quantity: 1; Termination: SMD/SMT; Number of Terminations: 2; Military Standard: Not; Max Power Dissipation: 100mW; Voltage Rating (DC): 50V; Features: Automotive AEC-Q200; Working Voltage: 50V; Length: 1mm; Height: 0.35mm; Width: 0.5mm; Depth: 0.5mm; Radiation Hardening: No; REACH SVHC: No SVHC; Lead Free: Lead Free; ComponentLink1URL: https://datasheet.ciiva.com/11821/0900766b80f80784-11821203.pdf?src-supplier=RSComponents; ComponentLink1Description: https://datasheet.ciiva.com/11821/0900766b80f80784-11821203.pdf?src-supplier=RSComponents; ComponentLink2URL: https://datasheet.ciiva.com/16767/70260748-16767559.pdf?src-supplier=Allied+Electronics; ComponentLink2Description: https://datasheet.ciiva.com/16767/70260748-16767559.pdf?src-supplier=Allied+Electronics; ComponentLink3URL: https://datasheet.ciiva.com/9198/aoa0000ce2-9198920.pdf?src-supplier=Avnet; ComponentLink3Description: https://datasheet.ciiva.com/9198/aoa0000ce2-9198920.pdf?src-supplier=Avnet; ComponentLink4URL: https://datasheet.ciiva.com/7942/aoa0000ce2-7942426.pdf?src-supplier=Element14; ComponentLink4Description: https://datasheet.ciiva.com/7942/aoa0000ce2-7942426.pdf?src-supplier=Element14; ComponentLink5URL: https://datasheet.ciiva.com/16523/aoa0000ce2-16523834.pdf?src-supplier=Avnet+Asia; ComponentLink5Description: https://datasheet.ciiva.com/16523/aoa0000ce2-16523834.pdf?src-supplier=Avnet+Asia; ComponentLink6URL: https://datasheet.ciiva.com/16771/70260748-16771979.pdf?src-supplier=Allied+Electronics; ComponentLink6Description: https://datasheet.ciiva.com/16771/70260748-16771979.pdf?src-supplier=Allied+Electronics; ComponentLink7URL: https://datasheet.ciiva.com/17215/aoa0000ce2-17215308.pdf?src-supplier=Avnet+Europe; ComponentLink7Description: https://datasheet.ciiva.com/17215/aoa0000ce2-17215308.pdf?src-supplier=Avnet+Europe; ComponentLink8URL: https://datasheet.ciiva.com/22673/1678782-22673916.pdf?src-supplier=Element14; ComponentLink8Description: https://datasheet.ciiva.com/22673/1678782-22673916.pdf?src-supplier=Element14; ComponentLink9URL: https://datasheet.ciiva.com/28532/1678782-28532109.pdf?src-supplier=Element14; ComponentLink9Description: https://datasheet.ciiva.com/28532/1678782-28532109.pdf?src-supplier=Element14
R18-R22 = R: RES 1.00K OHM 1/10W 1% 0402 SMD; Manufacturer 1: Panasonic; Manufacturer Part Number 1: ERJ-2RKF1002X; Resistance: 10kR; Temperature Coefficient: 100ppm/°C; Power Rating: 100mW; Voltage Rating: 50V; Supplier 1: Digi-Key; Supplier Part Number 1: P10.0KLCT-ND; Mount: Surface Mount; Case/Package: 0402; Number of Pins: 2; Contact Plating: Tin; Case Code (Metric): 1005; Case Code (Imperial): 0402; Min Operating Temperature: -55°C; Max Operating Temperature: 155°C; Tolerance: 1%; Composition: Thick Film; Packaging: Tape and Reel; Package Quantity: 1; Number of Terminations: 2; Termination: SMD/SMT; Military Standard: Not; Max Power Dissipation: 100mW; Voltage Rating (DC): 50V; Features: Automotive AEC-Q200; Length: 1mm; Height: 0.35mm; Width: 0.02inch; Depth: 0.5mm; Radiation Hardening: No; REACH SVHC: No SVHC; Lead Free: Lead Free; ComponentLink1URL: https://datasheet.ciiva.com/11821/0900766b80f80784-11821171.pdf?src-supplier=RSComponents; ComponentLink1Description: https://datasheet.ciiva.com/11821/0900766b80f80784-11821171.pdf?src-supplier=RSComponents; ComponentLink2URL: https://datasheet.ciiva.com/17212/aoa0000ce2-17212102.pdf?src-supplier=Avnet+Europe; ComponentLink2Description: https://datasheet.ciiva.com/17212/aoa0000ce2-17212102.pdf?src-supplier=Avnet+Europe; ComponentLink3URL: https://datasheet.ciiva.com/28514/1678782-28514185.pdf?src-supplier=Element14; ComponentLink3Description: https://datasheet.ciiva.com/28514/1678782-28514185.pdf?src-supplier=Element14; ComponentLink4URL: https://datasheet.ciiva.com/43467/1678782-43467402.pdf?src-supplier=Farnell; ComponentLink4Description: https://datasheet.ciiva.com/43467/1678782-43467402.pdf?src-supplier=Farnell; ComponentLink5URL: https://datasheet.ciiva.com/27055/1987020-27055643.pdf?src-supplier=Jameco; ComponentLink5Description: https://datasheet.ciiva.com/27055/1987020-27055643.pdf?src-supplier=Jameco; ComponentLink6URL: https://datasheet.ciiva.com/48531/aoa0000ce2-48531069.pdf?src-supplier=Avnet; ComponentLink6Description: https://datasheet.ciiva.com/48531/aoa0000ce2-48531069.pdf?src-supplier=Avnet; ComponentLink7URL: https://datasheet.ciiva.com/30201/aoa0000ce2-30201022.pdf?src-supplier=Onlinecomponents.com; ComponentLink7Description: https://datasheet.ciiva.com/30201/aoa0000ce2-30201022.pdf?src-supplier=Onlinecomponents.com; ComponentLink8URL: https://datasheet.ciiva.com/16199/aoa0000ce2-16199478.pdf?src-supplier=Future+Electronics; ComponentLink8Description: https://datasheet.ciiva.com/16199/aoa0000ce2-16199478.pdf?src-supplier=Future+Electronics; ComponentLink9URL: https://datasheet.ciiva.com/24023/aoa0000ce2-24023017.pdf?src-supplier=Mouser; ComponentLink9Description: https://datasheet.ciiva.com/24023/aoa0000ce2-24023017.pdf?src-supplier=Mouser; ComponentLink10URL: https://datasheet.ciiva.com/9194/aoa0000ce2-9194142.pdf?src-supplier=Avnet; ComponentLink10Description: https://datasheet.ciiva.com/9194/aoa0000ce2-9194142.pdf?src-supplier=Avnet; ComponentLink11URL: https://datasheet.ciiva.com/16782/70260748-16782590.pdf?src-supplier=Allied+Electronics; ComponentLink11Description: https://datasheet.ciiva.com/16782/70260748-16782590.pdf?src-supplier=Allied+Electronics; ComponentLink12URL: https://datasheet.ciiva.com/16786/70260748-16786734.pdf?src-supplier=Allied+Electronics; ComponentLink12Description: https://datasheet.ciiva.com/16786/70260748-16786734.pdf?src-supplier=Allied+Electronics
U1 = PARTICLE_P1: P1 WI-FI MODULE; Manufacturer Part Number 1: P1REEL; Supplier 1: Digi-Key; Supplier Part Number 1: 1878-1020-1-ND; Manufacturer 1: Particle
U2 = AP63205: IC REG BUCK 5V 2A TSOT26; Manufacturer 1: Diodes; Manufacturer Part Number 1: AP63205WU-7; Supplier 1: Digi-Key; Supplier Part Number 1: AP63205WU-7DICT-ND
U3 = LM3940: IC REG LDO 1A 5V SOT-223; Manufacturer 1: TI National Semiconductor; Manufacturer Part Number 1: LM3940IMPX-3.3/NOPB; Max Input Voltage: 7.5V; Output Voltage: 3.3V; Number of Outputs: 1; Min Input Voltage: 4.5V; Polarity: Positive; Quiescent Current: 15mA; Output Type: Fixed; Dropout Voltage: 500mV; Supplier 1: Digi-Key; Supplier Part Number 1: LM3940IMPX-3.3/NOPBCT-ND; Mount: Surface Mount; Case/Package: SOT-223; Number of Pins: 4; Contact Plating: Tin; Min Operating Temperature: -40°C; Max Operating Temperature: 125°C; Max Output Current: 1A; Package Quantity: 2000; Output Current: 1A; Packaging: Tape and Reel; Number of Regulators: 1; Radiation Hardening: No; Lead Free: Lead Free; ComponentLink1URL: https://datasheet.ciiva.com/12956/snvs114d-80171-12956736.pdf?src-supplier=Mouser; ComponentLink1Description: https://datasheet.ciiva.com/12956/snvs114d-80171-12956736.pdf?src-supplier=Mouser; ComponentLink2URL: https://datasheet.ciiva.com/27051/1282919-27051818.pdf?src-supplier=Jameco; ComponentLink2Description: https://datasheet.ciiva.com/27051/1282919-27051818.pdf?src-supplier=Jameco; ComponentLink3URL: https://datasheet.ciiva.com/3225/lm3940-3225415.pdf?src-supplier=Avnet; ComponentLink3Description: https://datasheet.ciiva.com/3225/lm3940-3225415.pdf?src-supplier=Avnet; ComponentLink4URL: https://datasheet.ciiva.com/6591/lm3940-6591738.pdf?src-supplier=Digi-Key; ComponentLink4Description: https://datasheet.ciiva.com/6591/lm3940-6591738.pdf?src-supplier=Digi-Key; ComponentLink5URL: https://datasheet.ciiva.com/26811/getdatasheetpartid-127471-26811034.pdf?src-supplier=Verical; ComponentLink5Description: https://datasheet.ciiva.com/26811/getdatasheetpartid-127471-26811034.pdf?src-supplier=Verical; ComponentLink6URL: https://datasheet.ciiva.com/6591/lm3940-6591740.pdf?src-supplier=Digi-Key; ComponentLink6Description: https://datasheet.ciiva.com/6591/lm3940-6591740.pdf?src-supplier=Digi-Key; ComponentLink7URL: https://datasheet.ciiva.com/6591/lm3940-6591742.pdf?src-supplier=Digi-Key; ComponentLink7Description: https://datasheet.ciiva.com/6591/lm3940-6591742.pdf?src-supplier=Digi-Key
U6 = TLV803SDBZR: Voltage Supervisor with Active-Low, Open Drain Reset, 1 Supply Monitored, -40 to 125 degC, 3-pin SOT-23 (DBZ), Green (RoHS & no Sb/Br); Manufacturer: Texas Instruments; Time Delay(ms): 200; Output Driver Type / Reset Output: Active-low, Open-drain; Rating: Catalog; VCC(Min)(V): 1.1; VCC(Max)(V): 6; Threshold Voltage 1 (typ)(Typ)(V): 2.93; SubFamily: Supervisor and Reset IC; # of Supplies Monitored: 1; Iq(Typ)(uA): 9; Reset Threshold Accuracy(%): 2; Description: IC VOLT SUPERVISR 2.93V SOT23-3; Max Supply Voltage: 6V; Min Supply Voltage: 1.1V; Nominal Supply Current: 30uA; Operating Supply Current: 20uA; Reset: Active Low; Reset Timeout: 120ms; Threshold Voltage: 2.93V; Max Reset Threshold Voltage: 2.99V; Min Reset Threshold Voltage: 2.87V; Quiescent Current: 9uA; PackageDescription: 3-Pin Plastic Small-Outline Package, 0.95 mm Pitch, 2.4 mm Lead Span; Mounting Technology: Surface Mount; ComponentLink1Description: Datasheet; Code_JEDEC: TO-236-AB; PackageReference: DBZ0003A; PartNumber: TLV803SDBZR; PackageVersion: revB, Apr-2005; DatasheetVersion: SBVS157B; ComponentLink1URL: http://www.ti.com/general/docs/lit/getliterature.tsp?genericPartNumber=TLV803S&fileType=pdf; Supplier 1: Digi-Key; Supplier Part Number 1: 296-29196-1-ND; Manufacturer 1: Texas Instruments; Manufacturer Part Number 1: TLV803SDBZR; Stock 1: 66193; Pricing 1: 1=0.61000, 10=0.53400, 100=0.40910, 500=0.32342, 1000=0.25874 (USD); RoHS: Yes; Mount: Surface Mount; Case/Package: SOT-23; Number of Pins: 3; Min Operating Temperature: -40°C; Max Operating Temperature: 125°C; Packaging: Tape and Reel; Package Quantity: 1; Type: Simple Reset/Power-On Reset; Number of Voltages Monitored: 1; Number of Elements: 1; Max Supply Current: 30uA; Watchdog Timer: No; Radiation Hardening: No; REACH SVHC: No SVHC; Lead Free: Lead Free; ComponentLink2URL: https://datasheet.ciiva.com/15105/getdatasheetpartid-544055-15105605.pdf?src-supplier=Verical; ComponentLink2Description: https://datasheet.ciiva.com/15105/getdatasheetpartid-544055-15105605.pdf?src-supplier=Verical; ComponentLink3URL: https://datasheet.ciiva.com/14203/tlv863m-14203548.pdf?src-supplier=Avnet; ComponentLink3Description: https://datasheet.ciiva.com/14203/tlv863m-14203548.pdf?src-supplier=Avnet; ComponentLink4URL: https://datasheet.ciiva.com/1979/tlv803m-1979837.pdf?src-supplier=Digi-Key; ComponentLink4Description: https://datasheet.ciiva.com/1979/tlv803m-1979837.pdf?src-supplier=Digi-Key; ComponentLink5URL: https://datasheet.ciiva.com/1979/tlv803m-1979838.pdf?src-supplier=Digi-Key; ComponentLink5Description: https://datasheet.ciiva.com/1979/tlv803m-1979838.pdf?src-supplier=Digi-Key; ComponentLink6URL: https://datasheet.ciiva.com/1979/tlv803m-1979839.pdf?src-supplier=Digi-Key; ComponentLink6Description: https://datasheet.ciiva.com/1979/tlv803m-1979839.pdf?src-supplier=Digi-Key; ComponentLink7URL: https://datasheet.ciiva.com/26070/sbvs157b-26070047.pdf?src-supplier=Avnet+Europe; ComponentLink7Description: https://datasheet.ciiva.com/26070/sbvs157b-26070047.pdf?src-supplier=Avnet+Europe